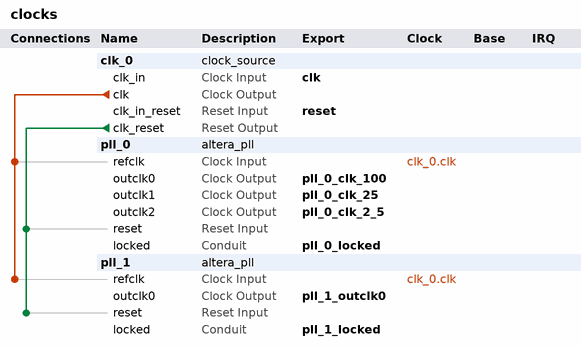
[diagram p0: system contents]
# Platform Designer (Qsys) system clocks, Cyclone V 5CSEBA6U23I7
# Parameters at their usual value, and those the tool derives, are not listed.
package require -exact qsys 17.0
create_system clocks
set_project_property DEVICE_FAMILY {Cyclone V}
set_project_property DEVICE 5CSEBA6U23I7

add_instance clk_0 clock_source 17.0
set_instance_parameter_value clk_0 clockFrequency 50000000

add_instance pll_0 altera_pll 17.0
set_instance_parameter_value pll_0 gui_device_speed_grade 1
set_instance_parameter_value pll_0 gui_number_of_clocks 3
set_instance_parameter_value pll_0 gui_operation_mode direct
set_instance_parameter_value pll_0 gui_output_clock_frequency0 100.0
set_instance_parameter_value pll_0 gui_output_clock_frequency1 25.0
set_instance_parameter_value pll_0 gui_output_clock_frequency2 2.5
set_instance_parameter_value pll_0 gui_pll_mode {Integer-N PLL}
set_instance_parameter_value pll_0 gui_reference_clock_frequency 50.0
set_instance_parameter_value pll_0 gui_use_locked true

add_instance pll_1 altera_pll 17.0
set_instance_parameter_value pll_1 gui_device_speed_grade 1
set_instance_parameter_value pll_1 gui_number_of_clocks 1
set_instance_parameter_value pll_1 gui_operation_mode direct
set_instance_parameter_value pll_1 gui_output_clock_frequency0 13.0
set_instance_parameter_value pll_1 gui_pll_mode {Integer-N PLL}
set_instance_parameter_value pll_1 gui_reference_clock_frequency 50.0
set_instance_parameter_value pll_1 gui_use_locked true

# connections
add_connection clk_0.clk pll_0.refclk clock
add_connection clk_0.clk pll_1.refclk clock
add_connection clk_0.clk_reset pll_0.reset reset
add_connection clk_0.clk_reset pll_1.reset reset

# exported interfaces
add_interface clk clock sink
set_interface_property clk EXPORT_OF clk_0.clk_in
add_interface pll_0_clk_100 clock source
set_interface_property pll_0_clk_100 EXPORT_OF pll_0.outclk0
add_interface pll_0_clk_25 clock source
set_interface_property pll_0_clk_25 EXPORT_OF pll_0.outclk1
add_interface pll_0_clk_2_5 clock source
set_interface_property pll_0_clk_2_5 EXPORT_OF pll_0.outclk2
add_interface pll_0_locked conduit end
set_interface_property pll_0_locked EXPORT_OF pll_0.locked
add_interface pll_1_locked conduit end
set_interface_property pll_1_locked EXPORT_OF pll_1.locked
add_interface pll_1_outclk0 clock source
set_interface_property pll_1_outclk0 EXPORT_OF pll_1.outclk0
add_interface reset reset sink
set_interface_property reset EXPORT_OF clk_0.clk_in_reset

set_interconnect_requirement {$system} qsys_mm.clockCrossingAdapter HANDSHAKE
set_interconnect_requirement {$system} qsys_mm.enableEccProtection FALSE
set_interconnect_requirement {$system} qsys_mm.insertDefaultSlave FALSE
set_interconnect_requirement {$system} qsys_mm.maxAdditionalLatency 1

save_system clocks.qsys
